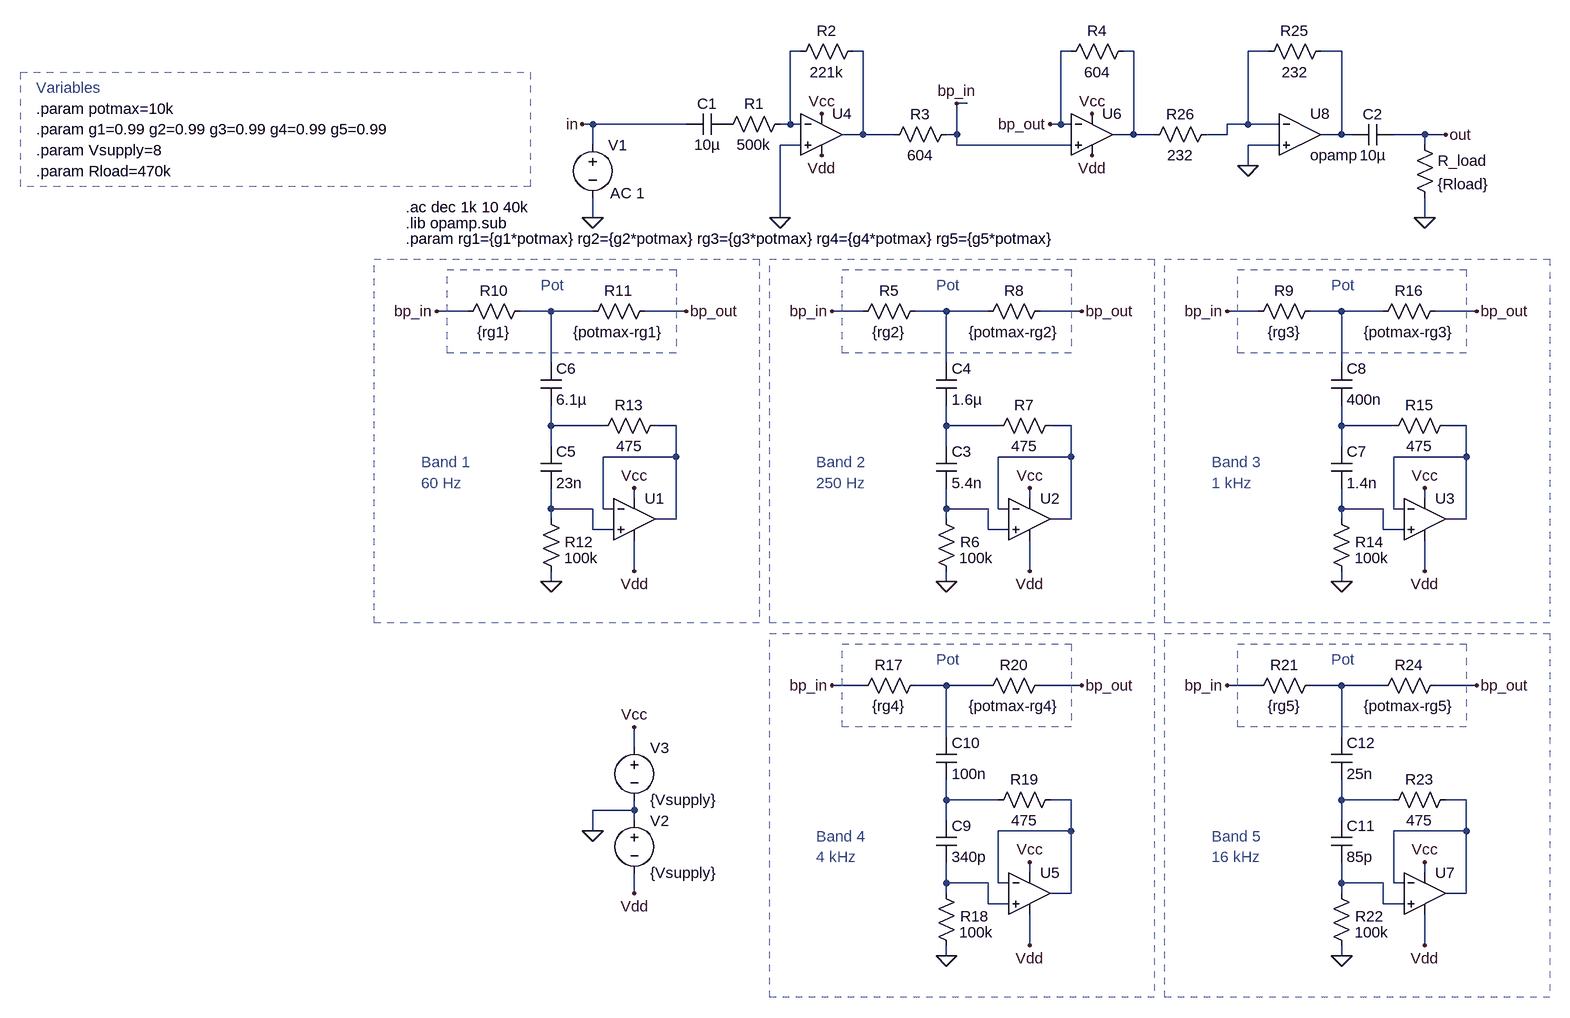
[diagram p0: schematic equaliser.asc]
equaliser.asc, the LTspice schematic file:
Version 4
SHEET 1 1204 2856
WIRE -16 -16 -32 -16
WIRE 80 -16 64 -16
WIRE 400 -16 384 -16
WIRE 496 -16 480 -16
WIRE 704 -16 672 -16
WIRE 816 -16 784 -16
WIRE 240 64 224 64
WIRE -336 96 -352 96
WIRE -192 96 -336 96
WIRE -32 96 -32 -16
WIRE -32 96 -48 96
WIRE -16 96 -32 96
WIRE 384 96 384 -16
WIRE 384 96 368 96
WIRE 400 96 384 96
WIRE 672 96 672 -16
WIRE 672 96 640 96
WIRE 720 96 672 96
WIRE 80 112 80 -16
WIRE 80 112 48 112
WIRE 128 112 80 112
WIRE 224 112 224 64
WIRE 224 112 208 112
WIRE 496 112 496 -16
WIRE 496 112 464 112
WIRE 528 112 496 112
WIRE 640 112 640 96
WIRE 640 112 608 112
WIRE 816 112 816 -16
WIRE 816 112 784 112
WIRE 832 112 816 112
WIRE 944 112 896 112
WIRE 976 112 944 112
WIRE -336 128 -336 96
WIRE -16 128 -48 128
WIRE 224 128 224 112
WIRE 400 128 224 128
WIRE 720 128 672 128
WIRE 944 128 944 112
WIRE 672 160 672 128
WIRE -336 240 -336 208
WIRE -48 240 -48 128
WIRE 944 240 944 208
WIRE -528 384 -576 384
WIRE -400 384 -448 384
WIRE -336 384 -400 384
WIRE -192 384 -256 384
WIRE 80 384 32 384
WIRE 208 384 160 384
WIRE 272 384 208 384
WIRE 416 384 352 384
WIRE 688 384 640 384
WIRE 816 384 768 384
WIRE 880 384 816 384
WIRE 1024 384 960 384
WIRE -400 464 -400 384
WIRE 208 464 208 384
WIRE 816 464 816 384
WIRE -400 560 -400 528
WIRE -320 560 -400 560
WIRE -208 560 -240 560
WIRE 208 560 208 528
WIRE 288 560 208 560
WIRE 400 560 368 560
WIRE 816 560 816 528
WIRE 896 560 816 560
WIRE 1008 560 976 560
WIRE -400 592 -400 560
WIRE 208 592 208 560
WIRE 816 592 816 560
WIRE -208 608 -208 560
WIRE -208 608 -320 608
WIRE 400 608 400 560
WIRE 400 608 288 608
WIRE 1008 608 1008 560
WIRE 1008 608 896 608
WIRE -272 672 -272 656
WIRE 336 672 336 656
WIRE 944 672 944 656
WIRE -400 688 -400 656
WIRE -336 688 -400 688
WIRE -320 688 -320 608
WIRE -304 688 -320 688
WIRE 208 688 208 656
WIRE 272 688 208 688
WIRE 288 688 288 608
WIRE 304 688 288 688
WIRE 816 688 816 656
WIRE 880 688 816 688
WIRE 896 688 896 608
WIRE 912 688 896 688
WIRE -400 704 -400 688
WIRE -208 704 -208 608
WIRE -208 704 -240 704
WIRE 208 704 208 688
WIRE 400 704 400 608
WIRE 400 704 368 704
WIRE 816 704 816 688
WIRE 1008 704 1008 608
WIRE 1008 704 976 704
WIRE -336 720 -336 688
WIRE -304 720 -336 720
WIRE 272 720 272 688
WIRE 304 720 272 720
WIRE 880 720 880 688
WIRE 912 720 880 720
WIRE -272 784 -272 736
WIRE 336 784 336 736
WIRE 944 784 944 736
WIRE -400 800 -400 784
WIRE 208 800 208 784
WIRE 816 800 816 784
WIRE 80 960 32 960
WIRE 208 960 160 960
WIRE 272 960 208 960
WIRE 416 960 352 960
WIRE 688 960 640 960
WIRE 816 960 768 960
WIRE 880 960 816 960
WIRE 1024 960 960 960
WIRE 208 1040 208 960
WIRE 816 1040 816 960
WIRE -272 1056 -272 1024
WIRE 208 1136 208 1104
WIRE 288 1136 208 1136
WIRE 400 1136 368 1136
WIRE 816 1136 816 1104
WIRE 896 1136 816 1136
WIRE 1008 1136 976 1136
WIRE -272 1152 -272 1136
WIRE -272 1152 -336 1152
WIRE -272 1168 -272 1152
WIRE 208 1168 208 1136
WIRE 816 1168 816 1136
WIRE -336 1184 -336 1152
WIRE 400 1184 400 1136
WIRE 400 1184 288 1184
WIRE 1008 1184 1008 1136
WIRE 1008 1184 896 1184
WIRE 336 1248 336 1232
WIRE 944 1248 944 1232
WIRE 208 1264 208 1232
WIRE 272 1264 208 1264
WIRE 288 1264 288 1184
WIRE 304 1264 288 1264
WIRE 816 1264 816 1232
WIRE 880 1264 816 1264
WIRE 896 1264 896 1184
WIRE 912 1264 896 1264
WIRE -272 1280 -272 1248
WIRE 208 1280 208 1264
WIRE 400 1280 400 1184
WIRE 400 1280 368 1280
WIRE 816 1280 816 1264
WIRE 1008 1280 1008 1184
WIRE 1008 1280 976 1280
WIRE 272 1296 272 1264
WIRE 304 1296 272 1296
WIRE 880 1296 880 1264
WIRE 912 1296 880 1296
WIRE 336 1360 336 1312
WIRE 944 1360 944 1312
WIRE 208 1376 208 1360
WIRE 816 1376 816 1360
FLAG -48 240 0
FLAG -336 240 0
FLAG 16 80 Vcc
FLAG 16 144 Vdd
FLAG -400 800 0
FLAG -272 656 Vcc
FLAG -272 784 Vdd
FLAG 224 64 bp_in
FLAG 368 96 bp_out
FLAG 432 144 Vdd
FLAG 432 80 Vcc
FLAG -336 1184 0
FLAG -272 1280 Vdd
FLAG -272 1024 Vcc
FLAG -192 384 bp_out
FLAG -576 384 bp_in
FLAG 976 112 out
FLAG -352 96 in
FLAG 208 800 0
FLAG 336 656 Vcc
FLAG 336 784 Vdd
FLAG 416 384 bp_out
FLAG 32 384 bp_in
FLAG 816 800 0
FLAG 944 656 Vcc
FLAG 944 784 Vdd
FLAG 1024 384 bp_out
FLAG 640 384 bp_in
FLAG 208 1376 0
FLAG 336 1232 Vcc
FLAG 336 1360 Vdd
FLAG 416 960 bp_out
FLAG 32 960 bp_in
FLAG 816 1376 0
FLAG 944 1232 Vcc
FLAG 944 1360 Vdd
FLAG 1024 960 bp_out
FLAG 640 960 bp_in
FLAG 944 240 0
FLAG 672 160 0
SYMBOL res -32 80 R90
WINDOW 0 0 56 VBottom 2
WINDOW 3 32 56 VTop 2
SYMATTR InstName R1
SYMATTR Value 500k
SYMBOL res 80 -32 R90
WINDOW 0 0 56 VBottom 2
WINDOW 3 32 56 VTop 2
SYMATTR InstName R2
SYMATTR Value 221k
SYMBOL res 224 96 R90
WINDOW 0 0 56 VBottom 2
WINDOW 3 32 56 VTop 2
SYMATTR InstName R3
SYMATTR Value 604
SYMBOL res 496 -32 R90
WINDOW 0 0 56 VBottom 2
WINDOW 3 32 56 VTop 2
SYMATTR InstName R4
SYMATTR Value 604
SYMBOL cap -192 80 M90
WINDOW 0 0 32 VBottom 2
WINDOW 3 32 32 VTop 2
SYMATTR InstName C1
SYMATTR Value 10µ
SYMBOL voltage -336 112 R0
WINDOW 123 27 90 Left 2
WINDOW 39 0 0 Left 0
SYMATTR Value2 AC 1
SYMATTR InstName V1
SYMATTR Value ""
SYMBOL OpAmps\\UniversalOpAmp 16 112 R0
SYMATTR InstName U4
SYMBOL OpAmps\\UniversalOpAmp 432 112 R0
SYMATTR InstName U6
SYMBOL res 928 112 R0
SYMATTR InstName R_load
SYMATTR Value {Rload}
SYMBOL res -432 368 R90
WINDOW 0 0 56 VBottom 2
WINDOW 3 32 56 VTop 2
SYMATTR InstName R10
SYMATTR Value {rg1}
SYMBOL cap -416 592 R0
SYMATTR InstName C5
SYMATTR Value 23n
SYMBOL res -416 688 R0
WINDOW 0 37 51 Left 2
SYMATTR InstName R12
SYMATTR Value 100k
SYMBOL cap -416 464 R0
SYMATTR InstName C6
SYMATTR Value 6.1µ
SYMBOL OpAmps\\UniversalOpAmp -272 704 R0
SYMATTR InstName U1
SYMBOL res -224 544 R90
WINDOW 0 0 56 VBottom 2
WINDOW 3 32 56 VTop 2
SYMATTR InstName R13
SYMATTR Value 475
SYMBOL res -240 368 R90
WINDOW 0 0 56 VBottom 2
WINDOW 3 32 56 VTop 2
SYMATTR InstName R11
SYMATTR Value {potmax-rg1}
SYMBOL voltage -272 1152 R0
WINDOW 123 0 0 Left 0
WINDOW 39 0 0 Left 0
SYMATTR InstName V2
SYMATTR Value {Vsupply}
SYMBOL voltage -272 1040 R0
WINDOW 123 0 0 Left 0
WINDOW 39 0 0 Left 0
SYMATTR InstName V3
SYMATTR Value {Vsupply}
SYMBOL res 176 368 R90
WINDOW 0 0 56 VBottom 2
WINDOW 3 32 56 VTop 2
SYMATTR InstName R5
SYMATTR Value {rg2}
SYMBOL cap 192 592 R0
SYMATTR InstName C3
SYMATTR Value 5.4n
SYMBOL res 192 688 R0
WINDOW 0 37 51 Left 2
SYMATTR InstName R6
SYMATTR Value 100k
SYMBOL cap 192 464 R0
SYMATTR InstName C4
SYMATTR Value 1.6µ
SYMBOL OpAmps\\UniversalOpAmp 336 704 R0
SYMATTR InstName U2
SYMBOL res 384 544 R90
WINDOW 0 0 56 VBottom 2
WINDOW 3 32 56 VTop 2
SYMATTR InstName R7
SYMATTR Value 475
SYMBOL res 368 368 R90
WINDOW 0 0 56 VBottom 2
WINDOW 3 32 56 VTop 2
SYMATTR InstName R8
SYMATTR Value {potmax-rg2}
SYMBOL res 784 368 R90
WINDOW 0 0 56 VBottom 2
WINDOW 3 32 56 VTop 2
SYMATTR InstName R9
SYMATTR Value {rg3}
SYMBOL cap 800 592 R0
SYMATTR InstName C7
SYMATTR Value 1.4n
SYMBOL res 800 688 R0
WINDOW 0 37 51 Left 2
SYMATTR InstName R14
SYMATTR Value 100k
SYMBOL cap 800 464 R0
SYMATTR InstName C8
SYMATTR Value 400n
SYMBOL OpAmps\\UniversalOpAmp 944 704 R0
SYMATTR InstName U3
SYMBOL res 992 544 R90
WINDOW 0 0 56 VBottom 2
WINDOW 3 32 56 VTop 2
SYMATTR InstName R15
SYMATTR Value 475
SYMBOL res 976 368 R90
WINDOW 0 0 56 VBottom 2
WINDOW 3 32 56 VTop 2
SYMATTR InstName R16
SYMATTR Value {potmax-rg3}
SYMBOL res 176 944 R90
WINDOW 0 0 56 VBottom 2
WINDOW 3 32 56 VTop 2
SYMATTR InstName R17
SYMATTR Value {rg4}
SYMBOL cap 192 1168 R0
SYMATTR InstName C9
SYMATTR Value 340p
SYMBOL res 192 1264 R0
WINDOW 0 37 51 Left 2
SYMATTR InstName R18
SYMATTR Value 100k
SYMBOL cap 192 1040 R0
SYMATTR InstName C10
SYMATTR Value 100n
SYMBOL OpAmps\\UniversalOpAmp 336 1280 R0
SYMATTR InstName U5
SYMBOL res 384 1120 R90
WINDOW 0 0 56 VBottom 2
WINDOW 3 32 56 VTop 2
SYMATTR InstName R19
SYMATTR Value 475
SYMBOL res 368 944 R90
WINDOW 0 0 56 VBottom 2
WINDOW 3 32 56 VTop 2
SYMATTR InstName R20
SYMATTR Value {potmax-rg4}
SYMBOL res 784 944 R90
WINDOW 0 0 56 VBottom 2
WINDOW 3 32 56 VTop 2
SYMATTR InstName R21
SYMATTR Value {rg5}
SYMBOL cap 800 1168 R0
SYMATTR InstName C11
SYMATTR Value 85p
SYMBOL res 800 1264 R0
WINDOW 0 37 51 Left 2
SYMATTR InstName R22
SYMATTR Value 100k
SYMBOL cap 800 1040 R0
SYMATTR InstName C12
SYMATTR Value 25n
SYMBOL OpAmps\\UniversalOpAmp 944 1280 R0
SYMATTR InstName U7
SYMBOL res 992 1120 R90
WINDOW 0 0 56 VBottom 2
WINDOW 3 32 56 VTop 2
SYMATTR InstName R23
SYMATTR Value 475
SYMBOL res 976 944 R90
WINDOW 0 0 56 VBottom 2
WINDOW 3 32 56 VTop 2
SYMATTR InstName R24
SYMATTR Value {potmax-rg5}
SYMBOL OpAmps\\opamp 752 48 R0
SYMATTR InstName U8
SYMBOL cap 896 96 R90
WINDOW 0 0 32 VBottom 2
WINDOW 3 32 32 VTop 2
SYMATTR InstName C2
SYMATTR Value 10µ
SYMBOL res 800 -32 R90
WINDOW 0 0 56 VBottom 2
WINDOW 3 32 56 VTop 2
SYMATTR InstName R25
SYMATTR Value 232
SYMBOL res 624 96 R90
WINDOW 0 0 56 VBottom 2
WINDOW 3 32 56 VTop 2
SYMATTR InstName R26
SYMATTR Value 232
TEXT -624 224 Left 2 !.ac dec 1k 10 40k
TEXT -624 248 Left 2 !.lib opamp.sub
TEXT -1192 104 Left 2 !.param g1=0.99 g2=0.99 g3=0.99 g4=0.99 g5=0.99
TEXT -1192 72 Left 2 !.param potmax=10k
TEXT -416 344 Left 2 ;Pot
TEXT -624 272 Left 2 !.param rg1={g1*potmax} rg2={g2*potmax} rg3={g3*potmax} rg4={g4*potmax} rg5={g5*potmax}
TEXT -1192 136 Left 2 !.param Vsupply=8
TEXT -1192 40 Left 2 ;Variables
TEXT -1192 168 Left 2 !.param Rload=470k
TEXT -600 616 Left 2 ;Band 1
TEXT 192 344 Left 2 ;Pot
TEXT 8 616 Left 2 ;Band 2
TEXT 800 344 Left 2 ;Pot
TEXT 616 616 Left 2 ;Band 3
TEXT 192 920 Left 2 ;Pot
TEXT 8 1192 Left 2 ;Band 4
TEXT 800 920 Left 2 ;Pot
TEXT 616 1192 Left 2 ;Band 5
TEXT -600 648 Left 2 ;60 Hz
TEXT 8 648 Left 2 ;250 Hz
TEXT 616 648 Left 2 ;1 kHz
TEXT 8 1224 Left 2 ;4 kHz
TEXT 616 1224 Left 2 ;16 kHz
RECTANGLE Normal -208 448 -560 320 2
RECTANGLE Normal -80 864 -672 304 2
RECTANGLE Normal 400 448 48 320 2
RECTANGLE Normal 528 864 -64 304 2
RECTANGLE Normal 1008 448 656 320 2
RECTANGLE Normal 1136 864 544 304 2
RECTANGLE Normal 400 1024 48 896 2
RECTANGLE Normal 528 1440 -64 880 2
RECTANGLE Normal 1008 1024 656 896 2
RECTANGLE Normal 1136 1440 544 880 2
RECTANGLE Normal -432 192 -1216 16 2

The netlist it stands for:
* equaliser.asc
R1 N001 P001 500k
R2 N002 N001 221k
R3 bp_in N002 604
R4 N003 bp_out 604
C1 in P001 10µ
V1 in 0 AC 1
XU4 0 N001 Vcc Vdd N002 level1 Avol=1Meg GBW=10Meg Vos=0 En=0 Enk=0 In=0 Ink=0 Rin=500Meg  ; pins In+ In- V+ V- OUT
XU6 bp_in bp_out Vcc Vdd N003 level1 Avol=1Meg GBW=10Meg Vos=0 En=0 Enk=0 In=0 Ink=0 Rin=500Meg  ; pins In+ In- V+ V- OUT
R_load out 0 {Rload}
R10 N006 bp_in {rg1}
C5 N009 N015 23n
R12 N015 0 100k
C6 N006 N009 6.1µ
XU1 N015 N010 Vcc Vdd N010 level1 Avol=1Meg GBW=10Meg Vos=0 En=0 Enk=0 In=0 Ink=0 Rin=500Meg  ; pins In+ In- V+ V- OUT
R13 N010 N009 475
R11 bp_out N006 {potmax-rg1}
V2 0 Vdd {Vsupply}
V3 Vcc 0 {Vsupply}
R5 N007 bp_in {rg2}
C3 N011 N016 5.4n
R6 N016 0 100k
C4 N007 N011 1.6µ
XU2 N016 N012 Vcc Vdd N012 level1 Avol=1Meg GBW=10Meg Vos=0 En=0 Enk=0 In=0 Ink=0 Rin=500Meg  ; pins In+ In- V+ V- OUT
R7 N012 N011 475
R8 bp_out N007 {potmax-rg2}
R9 N008 bp_in {rg3}
C7 N013 N017 1.4n
R14 N017 0 100k
C8 N008 N013 400n
XU3 N017 N014 Vcc Vdd N014 level1 Avol=1Meg GBW=10Meg Vos=0 En=0 Enk=0 In=0 Ink=0 Rin=500Meg  ; pins In+ In- V+ V- OUT
R15 N014 N013 475
R16 bp_out N008 {potmax-rg3}
R17 N018 bp_in {rg4}
C9 N020 N024 340p
R18 N024 0 100k
C10 N018 N020 100n
XU5 N024 N021 Vcc Vdd N021 level1 Avol=1Meg GBW=10Meg Vos=0 En=0 Enk=0 In=0 Ink=0 Rin=500Meg  ; pins In+ In- V+ V- OUT
R19 N021 N020 475
R20 bp_out N018 {potmax-rg4}
R21 N019 bp_in {rg5}
C11 N022 N025 85p
R22 N025 0 100k
C12 N019 N022 25n
XU7 N025 N023 Vcc Vdd N023 level1 Avol=1Meg GBW=10Meg Vos=0 En=0 Enk=0 In=0 Ink=0 Rin=500Meg  ; pins In+ In- V+ V- OUT
R23 N023 N022 475
R24 bp_out N019 {potmax-rg5}
XU8 N004 0 N005 opamp Aol=100K GBW=10Meg  ; pins invin noninvin out
C2 out N005 10µ
R25 N005 N004 232
R26 N004 N003 232
.ac dec 1k 10 40k
.lib opamp.sub
.param g1=0.99 g2=0.99 g3=0.99 g4=0.99 g5=0.99
.param potmax=10k
* Pot
.param rg1={g1*potmax} rg2={g2*potmax} rg3={g3*potmax} rg4={g4*potmax} rg5={g5*potmax}
.param Vsupply=8
* Variables
.param Rload=470k
* Band 1
* Pot
* Band 2
* Pot
* Band 3
* Pot
* Band 4
* Pot
* Band 5
* 60 Hz
* 250 Hz
* 1 kHz
* 4 kHz
* 16 kHz
.lib UniversalOpAmp1.lib
.backanno
.end